# EAGLE design Sp_pico (EAGLE 9.6.2)
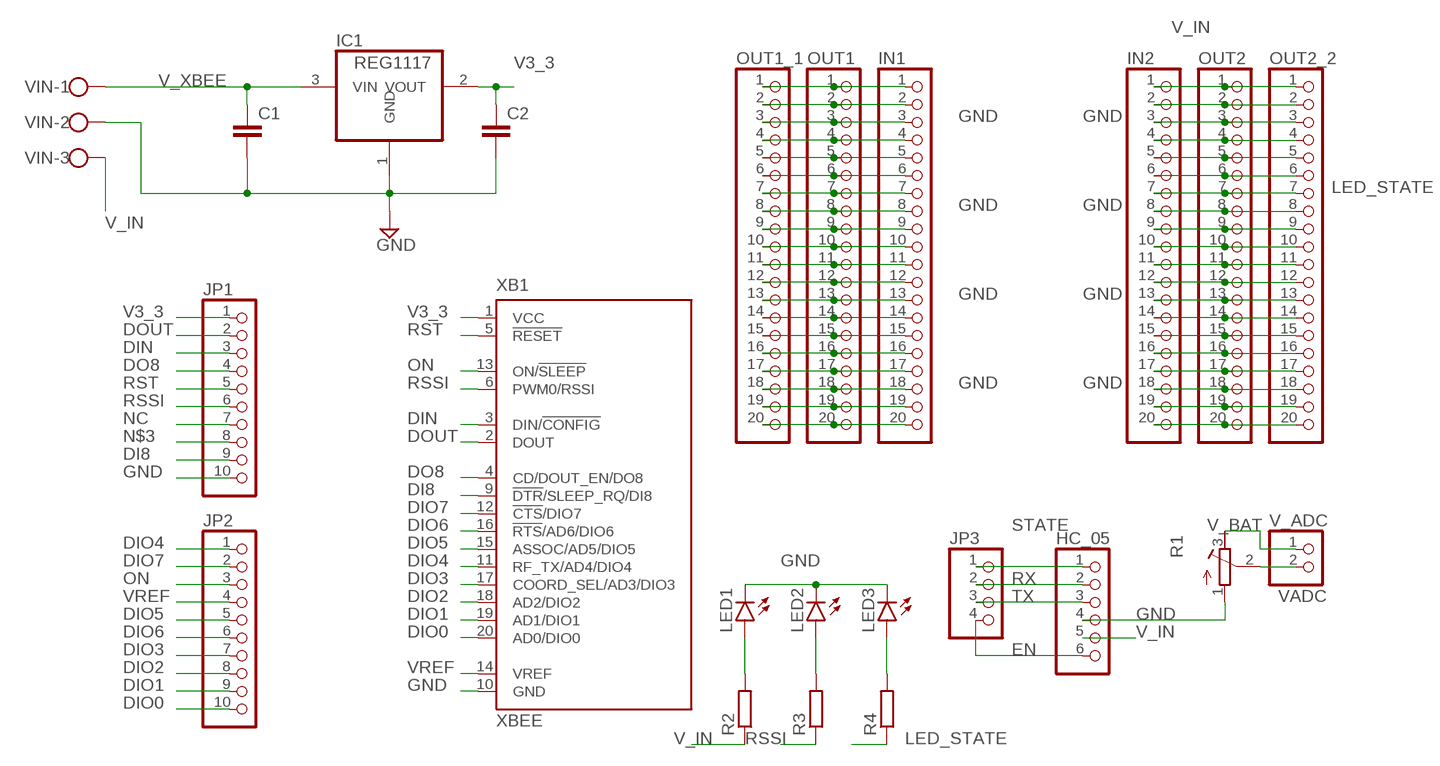
[diagram p0: schematic, sheet 1]

## Parts
C1  C2.5/5  [C2.5-5]
C2  C2.5/5  [C2.5-5]
HC_05  PINHD-1X6  [1X06]
IC1  REG1117  [SOT223]
IN1  PINHD-1X20  [1X20]
IN2  PINHD-1X20  [1X20]
JP1  PINHD-1X10  [1X10]
JP2  PINHD-1X10  [1X10]
JP3  PINHD-1X4  [1X04]
LED1  LED5MM  [LED5MM]
LED2  LED5MM  [LED5MM]
LED3  LED5MM  [LED5MM]
OUT1  PINHD-1X20  [1X20]
OUT1_1  PINHD-1X20  [1X20]
OUT2  PINHD-1X20  [1X20]
OUT2_2  PINHD-1X20  [1X20]
R1  R-TRIMM3296X  [RTRIM3296X]
R2  R-EU_0204/7  [0204/7]
R3  R-EU_0204/7  [0204/7]
R4  R-EU_0204/7  [0204/7]
V_ADC  PINHD-1X2  [1X02]
VIN  W237-103  [W237-103]
XB1  XBEE  [XBEE]

## Nets
DI8: JP1.9 XB1.9(!DTR!/SLEEP_RQ/DI8)
DIN: JP1.3 XB1.3(DIN/!CONFIG)
DIO0: JP2.10 XB1.20(AD0/DIO0)
DIO1: JP2.9 XB1.19(AD1/DIO1)
DIO2: JP2.8 XB1.18(AD2/DIO2)
DIO3: JP2.7 XB1.17(COORD_SEL/AD3/DIO3)
DIO4: JP2.1 XB1.11(RF_TX/AD4/DIO4)
DIO5: JP2.5 XB1.15(ASSOC/AD5/DIO5)
DIO6: JP2.6 XB1.16(!RTS!/AD6/DIO6)
DIO7: JP2.2 XB1.12(!CTS!/DIO7)
DO8: JP1.4 XB1.4(CD/DOUT_EN/DO8)
DOUT: JP1.2 XB1.2(DOUT)
EN: HC_05.6 JP3.4
GND: C1.2 C2.2 HC_05.4 IC1.1(GND) IN1.3 IN1.8 IN1.13 IN1.18 IN2.3 IN2.8 IN2.13 IN2.18 JP1.10 LED1.K(C) LED2.K(C) LED3.K(C) OUT1.3 OUT1.8 OUT1.13 OUT1.18 OUT1_1.3 OUT1_1.8 OUT1_1.13 OUT1_1.18 OUT2.3 OUT2.8 OUT2.13 OUT2.18 OUT2_2.3 OUT2_2.8 OUT2_2.13 OUT2_2.18 R1.1(A) VIN.2 XB1.10(GND)
LED_STATE: IN2.7 OUT2.7 OUT2_2.7 R4.1
N$1: IN1.1 OUT1.1 OUT1_1.1
N$2: IN1.2 OUT1.2 OUT1_1.2
N$3: JP1.8
N$4: IN1.4 OUT1.4 OUT1_1.4
N$5: IN1.5 OUT1.5 OUT1_1.5
N$6: IN1.6 OUT1.6 OUT1_1.6
N$7: IN1.7 OUT1.7 OUT1_1.7
N$8: LED1.A R2.2
N$9: IN1.9 OUT1.9 OUT1_1.9
N$10: IN1.10 OUT1.10 OUT1_1.10
N$11: IN1.11 OUT1.11 OUT1_1.11
N$12: IN1.12 OUT1.12 OUT1_1.12
N$13: LED2.A R3.2
N$14: IN1.14 OUT1.14 OUT1_1.14
N$15: IN1.15 OUT1.15 OUT1_1.15
N$16: IN1.16 OUT1.16 OUT1_1.16
N$17: IN1.17 OUT1.17 OUT1_1.17
N$18: LED3.A R4.2
N$19: IN1.19 OUT1.19 OUT1_1.19
N$20: IN1.20 OUT1.20 OUT1_1.20
N$22: IN2.2 OUT2.2 OUT2_2.2
N$24: IN2.4 OUT2.4 OUT2_2.4
N$25: IN2.5 OUT2.5 OUT2_2.5
N$26: IN2.6 OUT2.6 OUT2_2.6
N$29: IN2.9 OUT2.9 OUT2_2.9
N$30: IN2.10 OUT2.10 OUT2_2.10
N$31: IN2.11 OUT2.11 OUT2_2.11
N$32: IN2.12 OUT2.12 OUT2_2.12
N$34: IN2.14 OUT2.14 OUT2_2.14
N$35: IN2.15 OUT2.15 OUT2_2.15
N$36: IN2.16 OUT2.16 OUT2_2.16
N$37: IN2.17 OUT2.17 OUT2_2.17
N$39: IN2.19 OUT2.19 OUT2_2.19
N$40: IN2.20 OUT2.20 OUT2_2.20
NC: JP1.7
ON: JP2.3 XB1.13(ON/!SLEEP)
RSSI: JP1.6 R3.1 XB1.6(PWM0/RSSI)
RST: JP1.5 XB1.5(!RESET)
RX: HC_05.2 JP3.2
STATE: HC_05.1 JP3.1
TX: HC_05.3 JP3.3
V3_3: C2.1 IC1.2(VOUT) JP1.1 XB1.1(VCC)
V_BAT: R1.3(E) V_ADC.1
V_IN: HC_05.5 IN2.1 OUT2.1 OUT2_2.1 R2.1 VIN.3
V_XBEE: C1.1 IC1.3(VIN) VIN.1
VADC: R1.2(S) V_ADC.2
VREF: JP2.4 XB1.14(VREF)

## Library data of the parts
C1 C2 = capacitor-wima:C: CAPACITOR naming: grid - package width
HC_05 = pinhead:PINHD-1X6: PIN HEADER
IC1 = burr-brown:REG1117: 800mA and 1A Low Dropout (LDO) Positive Regulator 1.8V, 2.5V, 2.85V, 3.3V, 5V, and Adj; MPN: REG1117; OC_FARNELL: 1097566; OC_NEWARK: 14P6981
IN1 IN2 OUT1 OUT1_1 OUT2 OUT2_2 = pinhead:PINHD-1X20: PIN HEADER
JP1 JP2 = pinhead:PINHD-1X10: PIN HEADER
JP3 = pinhead:PINHD-1X4: PIN HEADER
LED1-LED3 = led:LED: LED OSRAM: - CHIPLED LG R971, LG N971, LY N971, LG Q971, LY Q971, LO R971, LY R971 LH N974, LH R974 LS Q976, LO Q976, LY Q976 LO Q996 - Hyper CHIPLED LW Q18S LB Q993, LB Q99A, LB R99A - SideLED LS A670, LO A670, LY A670, LG A670, LP A670 LB A673, LV A673, LT A673, LW A673 LH A674 LY A675 LS A676, LA A676, LO A676, LY A676, LW A676 LS A679, LY A679, LG A679 - Hyper Micro SIDELED® LS Y876, LA Y876, LO Y876, LY Y876 LT Y87S - SmartLED LW L88C, LW L88S LB L89C, LB L89S, LG L890 LS L89K, LO L89K, LY L89K LS L896, LA L896, LO L896, LY L896 - TOPLED LS T670, LO T670, LY T670, LG T670, LP T670 LSG T670, LSP T670, LSY T670, LOP T670, LYG T670 LG T671, LOG T671, LSG T671 LB T673, LV T673, LT T673, LW T673 LH T674 LS T676, LA T676, LO T676, LY T676, LB T676, LH T676, LSB T676, LW T676 LB T67C, LV T67C, LT T67C, LS T67K, LO T67K, LY T67K, LW E67C LS E67B, LA E67B, LO E67B, LY E67B, LB E67C, LV E67C, LT E67C LW T67C LS T679, LY T679, LG T679 LS T770, LO T770, LY T770, LG T770, LP T770 LB T773, LV T773, LT T773, LW T773 LH T774 LS E675, LA E675, LY E675, LS T675 LS T776, LA T776, LO T776, LY T776, LB T776 LHGB T686 LT T68C, LB T68C - Hyper Mini TOPLED® LB M676 - Mini TOPLED Santana® LG M470 LS M47K, LO M47K, LY M47K Source: http://www.osram.convergy.de LUXEON: - LUMILED® LXK2-PW12-R00, LXK2-PW12-S00, LXK2-PW14-U00, LXK2-PW14-V00 LXK2-PM12-R00, LXK2-PM12-S00, LXK2-PM14-U00 LXK2-PE12-Q00, LXK2-PE12-R00, LXK2-PE12-S00, LXK2-PE14-T00, LXK2-PE14-U00 LXK2-PB12-K00, LXK2-PB12-L00, LXK2-PB12-M00, LXK2-PB14-N00, LXK2-PB14-P00, LXK2-PB14-Q00 LXK2-PR12-L00, LXK2-PR12-M00, LXK2-PR14-Q00, LXK2-PR14-R00 LXK2-PD12-Q00, LXK2-PD12-R00, LXK2-PD12-S00 LXK2-PH12-R00, LXK2-PH12-S00 LXK2-PL12-P00, LXK2-PL12-Q00, LXK2-PL12-R00 Source: www.luxeon.com KINGBRIGHT: KA-3528ASYC Source: www.kingbright.com
R1 = rcl:R-TRIMM: Trimm resistor; SPICEMODEL: X; SPICEPREFIXL: POT
R2-R4 = rcl:R-EU_: RESISTOR, European symbol; SPICEPREFIX: R
V_ADC = pinhead:PINHD-1X2: PIN HEADER
VIN = con-wago-500:W237-103: WAGO SCREW CLAMP; MPN: 237-103; OC_FARNELL: unknown; OC_NEWARK: 18M7116
XB1 = maxstream:XBEE: XBee (TM) /XBee-PRO(TM) OEM RF Modules Source: MaxStream, Inc. xbee_productmanual.pdf; MPN: XBP24-Z7UIT-004; OC_FARNELL: 1751799; OC_NEWARK: 34R5507

## Board
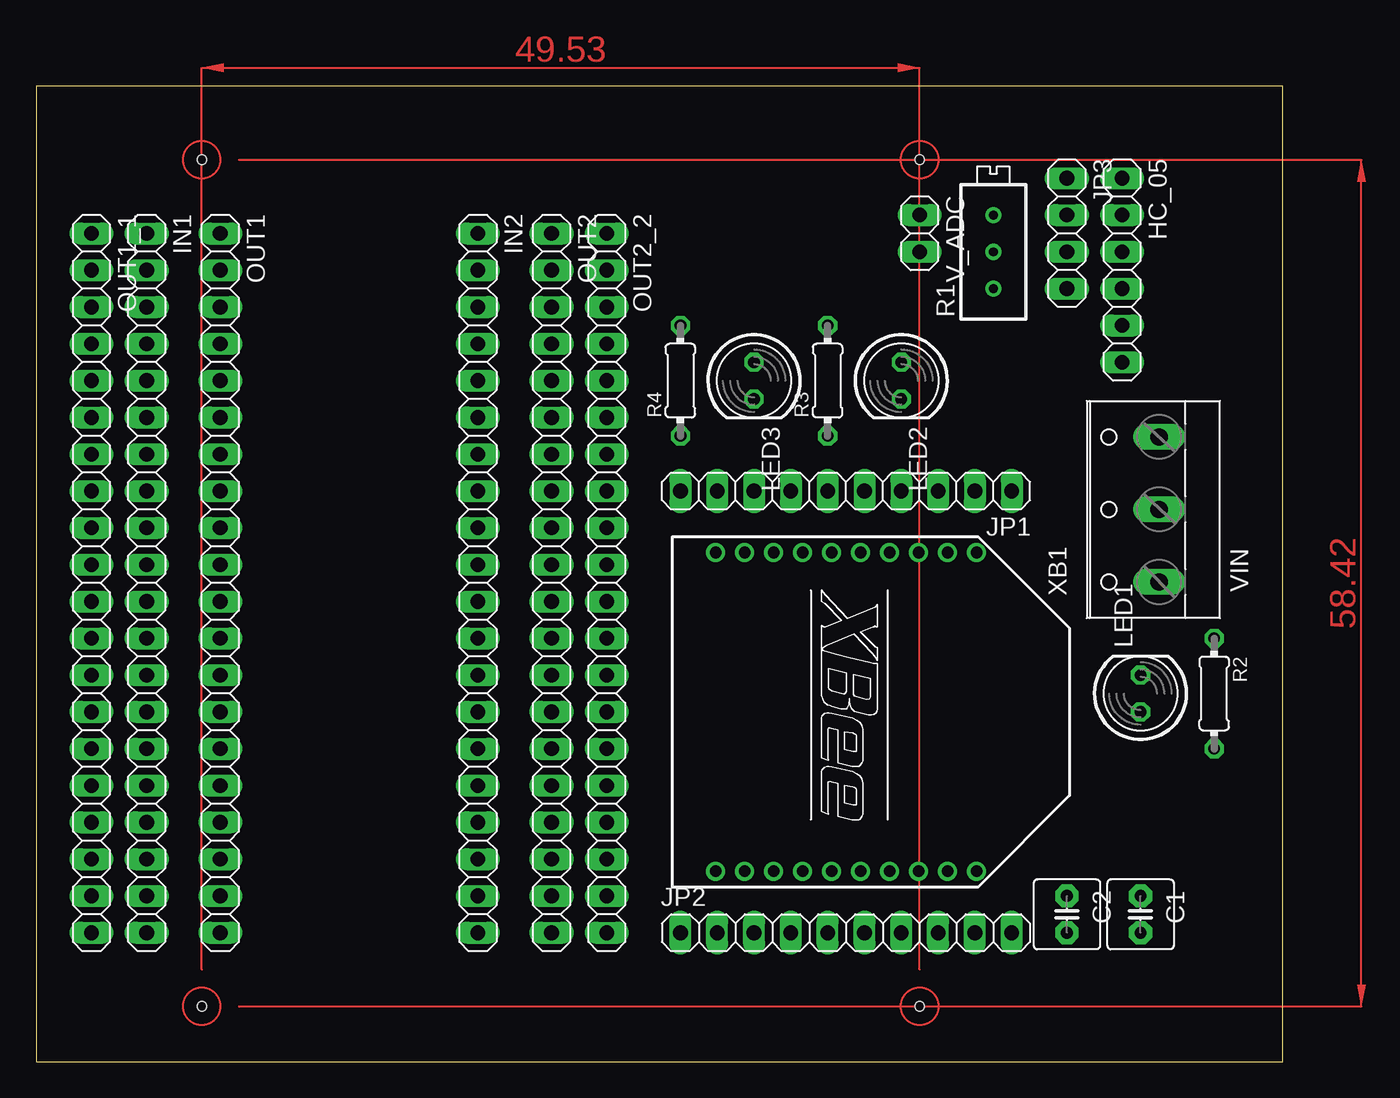
[diagram p1: board, top side]
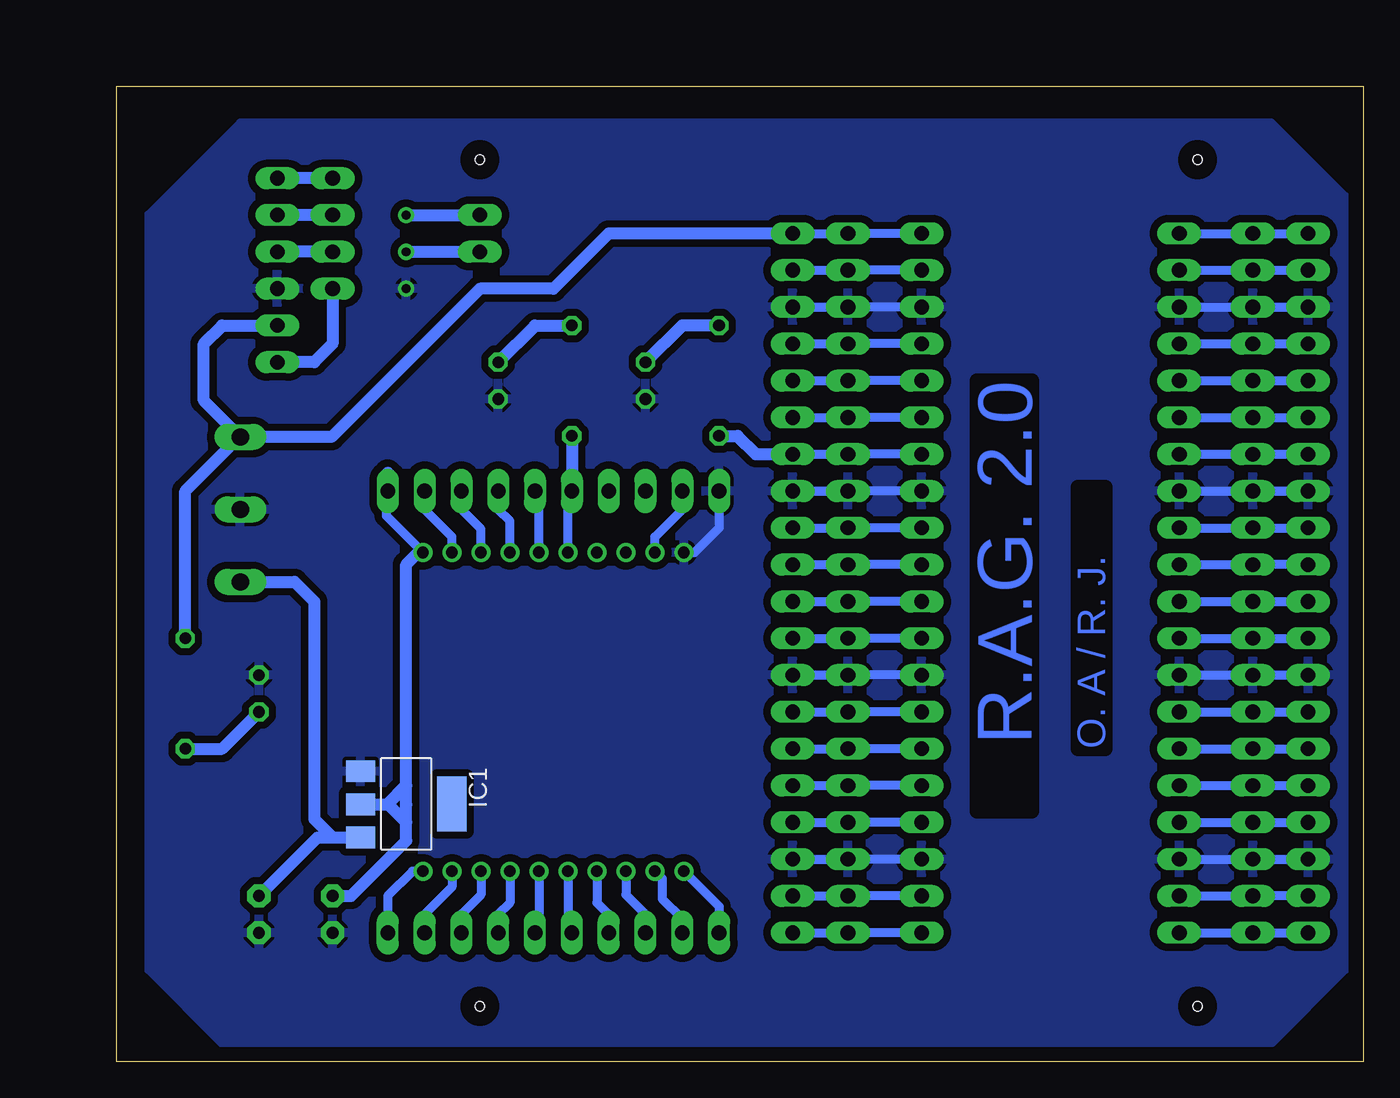
[diagram p2: board, bottom side, seen from below]

Size 86.03 x 67.3 mm. Coordinates in mm from the lower left corner, seen from the top.
Outline: 0,0 86.03,0 86.03,67.3 0,67.3 0,0
Copper layers (1*16): Top 0.035mm / dielectric 1.5mm / Bottom 0.035mm
Design rules "default *": minimum track width 6mil, minimum drill 0.35mm, track to track 20mil, track to pad 20mil, pad to pad 20mil, via to via 20mil, smd to smd 6mil, copper to edge 40mil, drill to drill 6mil, minimum pad ring 10mil, minimum via ring 8mil, stop-mask expansion 4mil, vias tented up to drill 0mil, thermal gap 10mil
Holes 0.65 mm at 11.43,3.81 60.96,3.81 60.96,62.23 11.43,62.23

### Footprints (pad centres in the part's own frame; a part is rotated, then mirrored left to right if it is on the bottom)
C2.5-5 = drill 0.813 pad 1.6 octagon: 1 -1.27,0; 2 1.27,0
1X06 = drill 1.016 long: 1 -6.35,0; 2 -3.81,0; 3 -1.27,0; 4 1.27,0; 5 3.81,0; 6 6.35,0
SOT223 = smd 1.499 x 2.007: 1 -2.261,-3.15; 2 0.025,-3.15; 3 2.311,-3.15 | smd 3.81 x 2.007: 4 0,3.15
1X20 = drill 1.016 long: 1 -24.13,0; 2 -21.59,0; 3 -19.05,0; 4 -16.51,0; 5 -13.97,0; 6 -11.43,0; 7 -8.89,0; 8 -6.35,0; 9 -3.81,0; 10 -1.27,0; 11 1.27,0; 12 3.81,0; 13 6.35,0; 14 8.89,0; 15 11.43,0; 16 13.97,0; 17 16.51,0; 18 19.05,0; 19 21.59,0; 20 24.13,0
1X10 = drill 1.016 long: 1 -11.43,0; 2 -8.89,0; 3 -6.35,0; 4 -3.81,0; 5 -1.27,0; 6 1.27,0; 7 3.81,0; 8 6.35,0; 9 8.89,0; 10 11.43,0
1X04 = drill 1.016 long: 1 -3.81,0; 2 -1.27,0; 3 1.27,0; 4 3.81,0
LED5MM = drill 0.813 octagon: A -1.27,0; K 1.27,0
RTRIM3296X = drill 0.61: 1 0,-2.54; 2 0,0; 3 0,2.54
0204/7 = drill 0.813 octagon: 1 -3.81,0; 2 3.81,0
1X02 = drill 1.016 long: 1 -1.27,0; 2 1.27,0
W237-103 = drill 1.194 long: 1 -5,-1.29; 2 0,-1.29; 3 5,-1.29
XBEE = drill 0.8 pad 1.27: 1 -11,9; 2 -11,7; 3 -11,5; 4 -11,3; 5 -11,1; 6 -11,-1; 7 -11,-3; 8 -11,-5; 9 -11,-7; 10 -11,-9; 11 11,-9; 12 11,-7; 13 11,-5; 14 11,-3; 15 11,-1; 16 11,1; 17 11,3; 18 11,5; 19 11,7; 20 11,9

### Placement (x,y rotation side)
C1  76.2,10.16 270 top
C2  71.12,10.16 270 top
HC_05  74.93,54.61 270 top
IC1  66.04,17.78 270 bottom
IN1  7.62,33.02 270 top
IN2  30.48,33.02 270 top
JP1  55.88,39.37 180 top
JP2  55.88,8.89 0 top
JP3  71.12,57.15 270 top
LED1  76.2,25.4 90 top
LED2  59.69,46.99 270 top
LED3  49.53,46.99 270 top
OUT1  12.7,33.02 270 top
OUT1_1  3.81,33.02 270 top
OUT2  35.56,33.02 270 top
OUT2_2  39.37,33.02 270 top
R1  66.04,55.88 0 top
R2  81.28,25.4 270 top
R3  54.61,46.99 90 top
R4  44.45,46.99 90 top
V_ADC  60.96,57.15 270 top
VIN  76.2,38.1 90 top
XB1  55.88,24.13 270 top

### Tracks (layer width: path | path; a pad name or v marks a point on that pad's centre or on a via)
DI8
  Bottom 0.61: XB1.9 48.88,36.21 46.99,38.1 JP1.9
DIN
  Bottom 0.61: XB1.3 60.88,36.75 62.23,38.1 JP1.3
DIO0
  Bottom 0.61: XB1.20 65.61,13.13 67.31,11.43 JP2.10
DIO1
  Bottom 0.61: XB1.19 62.88,12.05 64.77,10.16 JP2.9
DIO2
  Bottom 0.61: XB1.18 60.88,11.51 62.23,10.16 JP2.8
DIO3
  Bottom 0.61: XB1.17 58.88,10.97 59.69,10.16 JP2.7
DIO4
  Bottom 0.61: XB1.11 44.45,10.7 JP2.1
DIO5
  Bottom 0.61: XB1.15 54.88,9.16 JP2.5
DIO6
  Bottom 0.61: XB1.16 56.88,9.16 JP2.6
DIO7
  Bottom 0.61: XB1.12 48.37,12.62 48.37,11.24 46.99,9.86 JP2.2
DO8
  Bottom 0.61: XB1.4 58.88,37.29 59.69,38.1 JP1.4
DOUT
  Bottom 0.61: JP1.2 64.77,38.1 62.88,36.21 XB1.2
EN
  Bottom 0.813: JP3.4 71.12,49.53 72.39,48.26 HC_05.6
GND
  Bottom 0.61: OUT1.3 IN1.3 OUT1_1.3 | OUT1.18 IN1.18 OUT1_1.18 | IN2.3 OUT2.3 OUT2_2.3 | IN2.18 OUT2.18 OUT2_2.18 | OUT1.13 IN1.13 OUT1_1.13 | OUT1.8 IN1.8 OUT1_1.8 | IN2.8 OUT2.8 OUT2_2.8 | IN2.13 OUT2.13 OUT2_2.13 | JP1.10 44.45,36.83 46.15,35.13 XB1.10
  pour Bottom: 1.27,6.35 1.27,59.69 6.35,64.77 77.47,64.77 83.82,58.42 83.82,6.35 78.74,1.27 6.35,1.27
LED_STATE
  Bottom 0.61: IN2.7 OUT2.7 OUT2_2.7
  Bottom 0.813: R4.1 43.18,43.18 41.91,41.91 OUT2_2.7
N$1
  Bottom 0.61: OUT1.1 IN1.1 OUT1_1.1
N$2
  Bottom 0.61: OUT1.2 IN1.2 OUT1_1.2
N$4
  Bottom 0.61: OUT1.4 IN1.4 OUT1_1.4
N$5
  Bottom 0.61: OUT1.5 IN1.5 OUT1_1.5
N$6
  Bottom 0.61: OUT1.6 IN1.6 OUT1_1.6
N$7
  Bottom 0.61: OUT1.7 IN1.7 OUT1_1.7
N$8
  Bottom 0.813: R2.2 78.74,21.59 LED1.A
N$9
  Bottom 0.61: OUT1.9 IN1.9 OUT1_1.9
N$10
  Bottom 0.61: OUT1.10 IN1.10 OUT1_1.10
N$11
  Bottom 0.61: OUT1.11 IN1.11 OUT1_1.11
N$12
  Bottom 0.61: OUT1.12 IN1.12 OUT1_1.12
N$13
  Bottom 0.813: LED2.A 57.15,50.8 R3.2
N$14
  Bottom 0.61: OUT1.14 IN1.14 OUT1_1.14
N$15
  Bottom 0.61: OUT1.15 IN1.15 OUT1_1.15
N$16
  Bottom 0.61: OUT1.16 IN1.16 OUT1_1.16
N$17
  Bottom 0.61: OUT1.17 IN1.17 OUT1_1.17
N$18
  Bottom 0.813: R4.2 46.99,50.8 LED3.A
N$19
  Bottom 0.61: OUT1.19 IN1.19 OUT1_1.19
N$20
  Bottom 0.61: OUT1.20 IN1.20 OUT1_1.20
N$22
  Bottom 0.61: IN2.2 OUT2.2 OUT2_2.2
N$24
  Bottom 0.61: IN2.4 OUT2.4 OUT2_2.4
N$25
  Bottom 0.61: IN2.5 OUT2.5 OUT2_2.5
N$26
  Bottom 0.61: IN2.6 OUT2.6 OUT2_2.6
N$29
  Bottom 0.61: IN2.9 OUT2.9 OUT2_2.9
N$30
  Bottom 0.61: IN2.10 OUT2.10 OUT2_2.10
N$31
  Bottom 0.61: IN2.11 OUT2.11 OUT2_2.11
N$32
  Bottom 0.61: IN2.12 OUT2.12 OUT2_2.12
N$34
  Bottom 0.61: IN2.14 OUT2.14 OUT2_2.14
N$35
  Bottom 0.61: IN2.15 OUT2.15 OUT2_2.15
N$36
  Bottom 0.61: IN2.16 OUT2.16 OUT2_2.16
N$37
  Bottom 0.61: IN2.17 OUT2.17 OUT2_2.17
N$39
  Bottom 0.61: IN2.19 OUT2.19 OUT2_2.19
N$40
  Bottom 0.61: IN2.20 OUT2.20 OUT2_2.20
ON
  Bottom 0.61: XB1.13 50.88,11.51 49.53,10.16 JP2.3
RSSI
  Bottom 0.61: XB1.6 54.88,39.1 JP1.6
  Bottom 0.813: R3.1 JP1.6
RST
  Bottom 0.61: XB1.5 56.88,39.1 JP1.5
RX
  Bottom 0.813: JP3.2 HC_05.2
STATE
  Bottom 0.813: JP3.1 HC_05.1
TX
  Bottom 0.813: JP3.3 HC_05.3
V3_3
  Bottom 0.61: JP1.1 67.42,39.26 67.42,37.67 65.04,35.29 XB1.1
  Bottom 0.813: 67.31,40.64 JP1.1 | 65.04,35.29 66.04,34.29 66.04,19.05 | C2.1 69.85,11.43 66.04,15.24 66.04,16.51 | 66.04,16.51 66.04,17.73 | 66.04,17.73 66.06,17.75 | 66.04,17.73 66.04,19.05 | IC1.2 67.33,17.75 | 67.33,17.75 66.04,19.05 | 67.33,17.75 67.28,17.75 66.04,16.51
V_BAT
  Bottom 0.813: R1.3 V_ADC.1
V_IN
  Bottom 0.61: IN2.1 OUT2.1 OUT2_2.1
  Bottom 0.813: R2.1 81.28,39.37 77.55,43.1 VIN.3 | VIN.3 80.01,45.62 80.01,49.53 78.74,50.8 HC_05.5 | OUT2_2.1 52.07,57.15 55.88,53.34 60.96,53.34 71.2,43.1 VIN.3
V_XBEE
  Bottom 0.813: C1.1 72.16,15.47 71.12,15.47 | 71.12,15.47 IC1.3 | VIN.1 73.74,33.1 72.39,31.75 72.39,19.05 72.39,18.24 72.39,16.74 71.12,15.47
VADC
  Bottom 0.813: R1.2 V_ADC.2
VREF
  Bottom 0.61: XB1.14 52.88,10.97 52.07,10.16 JP2.4
(copper drawn outside any net)
  shapes: Top area x2, Top circle x4

### Text on the board
Bottom: R.A.G. 2.0 | O. A / R. J.